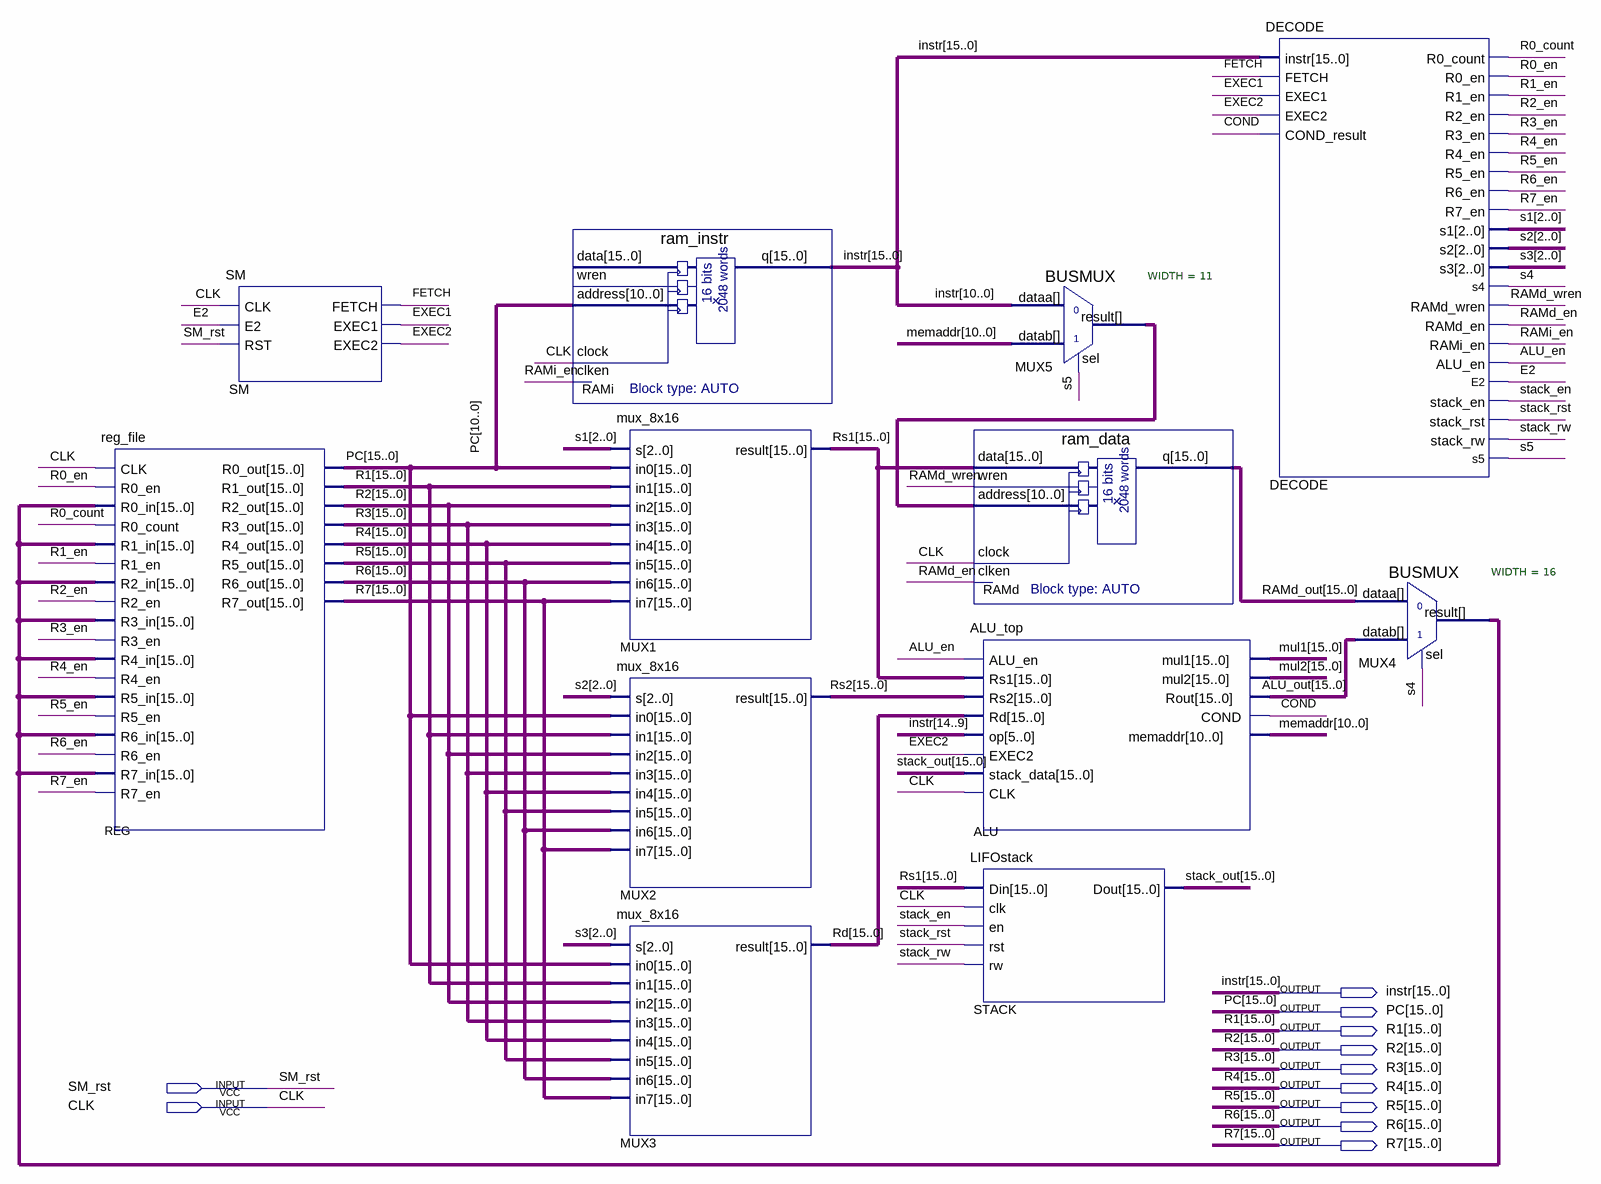
[diagram p0: schematic sheet]
// Quartus schematic CPUProject.bdf as structural Verilog: 12 symbols, 11 pins
module CPUProject (
  input  SM_rst,
  input  CLK,
  output [15:0] instr,
  output [15:0] PC,
  output [15:0] R1,
  output [15:0] R2,
  output [15:0] R3,
  output [15:0] R4,
  output [15:0] R5,
  output [15:0] R6,
  output [15:0] R7
);

  wire ALU_en, COND, E2, EXEC1, EXEC2, FETCH, R0_count, R0_en, R1_en, R2_en, R3_en, R4_en, R5_en, R6_en,
       R7_en, RAMd_en, RAMd_wren, RAMi_en, s4, s5, stack_en, stack_rst, stack_rw;
  wire [2:0] s1, s2, s3;
  wire [10:0] memaddr, MUX5_result;
  wire [15:0] ALU_out, mul1, mul2, MUX4_result, RAMd_out, Rd, Rs1, Rs2, stack_out;

  reg_file REG (
    .CLK(CLK), .R0_en(R0_en), .R0_in(MUX4_result), .R0_count(R0_count), .R1_in(MUX4_result), .R1_en(R1_en),
    .R2_in(MUX4_result), .R2_en(R2_en), .R3_in(MUX4_result), .R3_en(R3_en), .R4_in(MUX4_result),
    .R4_en(R4_en), .R5_in(MUX4_result), .R5_en(R5_en), .R6_in(MUX4_result), .R6_en(R6_en),
    .R7_in(MUX4_result), .R7_en(R7_en), .R0_out(PC), .R1_out(R1), .R2_out(R2), .R3_out(R3), .R4_out(R4),
    .R5_out(R5), .R6_out(R6), .R7_out(R7));
  SM SM (.CLK(CLK), .E2(E2), .RST(SM_rst), .FETCH(FETCH), .EXEC1(EXEC1), .EXEC2(EXEC2));
  ram_instr RAMi (.address(PC[10:0]), .clock(CLK), .clken(RAMi_en), .q(instr));  // open: data, wren
  mux_8x16 MUX1 (.s(s1), .in0(PC), .in1(R1), .in2(R2), .in3(R3), .in4(R4), .in5(R5), .in6(R6), .in7(R7), .result(Rs1));
  mux_8x16 MUX2 (.s(s2), .in0(PC), .in1(R1), .in2(R2), .in3(R3), .in4(R4), .in5(R5), .in6(R6), .in7(R7), .result(Rs2));
  mux_8x16 MUX3 (.s(s3), .in0(PC), .in1(R1), .in2(R2), .in3(R3), .in4(R4), .in5(R5), .in6(R6), .in7(R7), .result(Rd));
  ram_data RAMd (.data(Rs1), .wren(RAMd_wren), .address(MUX5_result), .clock(CLK), .clken(RAMd_en), .q(RAMd_out));
  ALU_top ALU (
    .ALU_en(ALU_en), .Rs1(Rs1), .Rs2(Rs2), .Rd(Rd), .op(instr[14:9]), .EXEC2(EXEC2), .stack_data(stack_out),
    .CLK(CLK), .mul1(mul1), .mul2(mul2), .Rout(ALU_out), .COND(COND), .memaddr(memaddr));
  LIFOstack STACK (.Din(Rs1), .clk(CLK), .en(stack_en), .rst(stack_rst), .rw(stack_rw), .Dout(stack_out));
  BUSMUX #(.WIDTH(11)) MUX5 (.datab(memaddr), .sel(s5), .dataa(instr[10:0]), .result(MUX5_result));
  DECODE DECODE (
    .instr(instr), .FETCH(FETCH), .EXEC1(EXEC1), .EXEC2(EXEC2), .COND_result(COND), .R0_count(R0_count),
    .R0_en(R0_en), .R1_en(R1_en), .R2_en(R2_en), .R3_en(R3_en), .R4_en(R4_en), .R5_en(R5_en), .R6_en(R6_en),
    .R7_en(R7_en), .s1(s1), .s2(s2), .s3(s3), .s4(s4), .RAMd_wren(RAMd_wren), .RAMd_en(RAMd_en),
    .RAMi_en(RAMi_en), .ALU_en(ALU_en), .E2(E2), .stack_en(stack_en), .stack_rst(stack_rst),
    .stack_rw(stack_rw), .s5(s5));
  BUSMUX #(.WIDTH(16)) MUX4 (.datab(ALU_out), .sel(s4), .dataa(RAMd_out), .result(MUX4_result));
endmodule
